# EAGLE schematic dimmerPower3 (EAGLE 9.2.0)
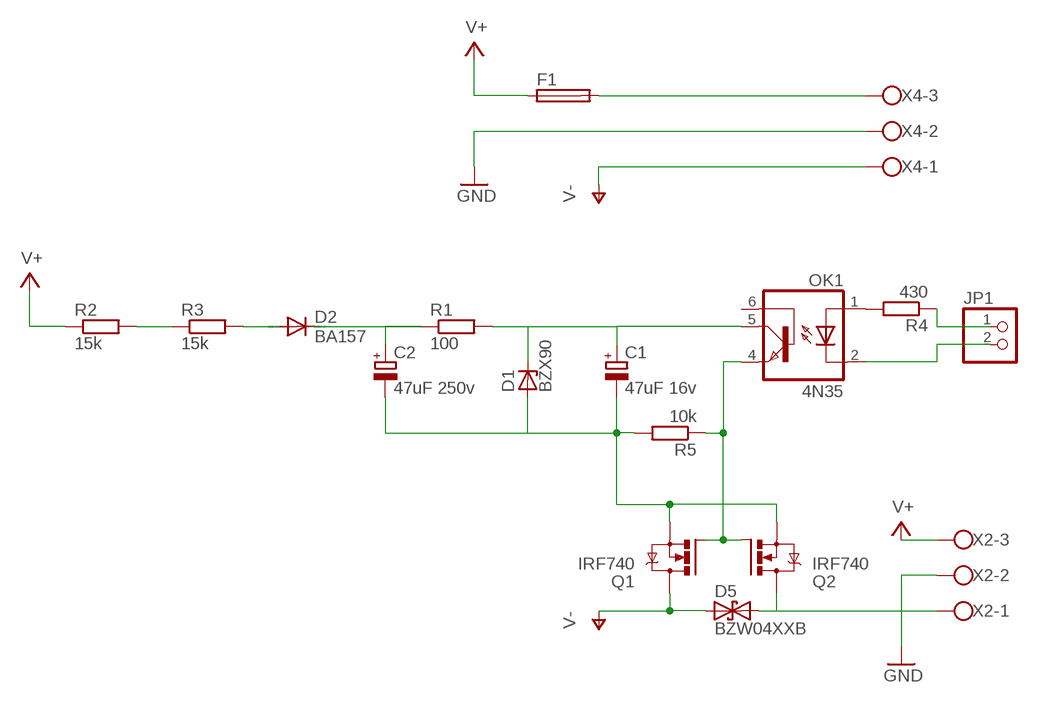
[diagram p0: schematic, sheet 1]

## Parts
C1  47uF 16v  CPOL-EUE2.5-6  [E2,5-6]
C2  47uF 250v  CPOL-EUE5-13  [E5-13]
D1  BZX90  [DO34Z7]
D2  BA157  [P1-10]
D5  BZW04XXB  [F126Z12]
F1  SH22,5  [SH22,5]
JP1  PINHD-1X2  [1X02]
OK1  4N35  [DIL06]
Q1  IRF740  [TO220BV]
Q2  IRF740  [TO220BV]
R1  100  R-EU_0204/7  [0204/7]
R2  15k  R-EU_0613/15  [P0613/15]
R3  15k  R-EU_0613/15  [P0613/15]
R4  430  R-EU_0204/7  [0204/7]
R5  10k  R-EU_0204/7  [0204/7]
X2  W237-103  [W237-103]
X4  W237-103  [W237-103]

## Nets
GND: X2.2 X4.2
N$2: JP1.1 R4.1
N$3: OK1.1(A) R4.2
N$4 [signal]: JP1.2 OK1.2(C)
N$7: R2.2 R3.1
N$8: D2.A R3.2
N$9: C2.+ D2.C R1.1
N$10: C1.+ D1.C OK1.5(COL) R1.2
N$11: OK1.4(EMI) Q1.G Q2.G R5.1
N$12: D5.C Q2.D X2.1
N$17: C1.- C2.- D1.A Q1.S Q2.S R5.2
V+: F1.1 R2.1 X2.3
V+1: F1.2 X4.3
V-: D5.A Q1.D X4.1
Unconnected: OK1.6(BAS)

## Library data of the parts
C1 C2 = rcl:CPOL-EU: POLARIZED CAPACITOR, European symbol; SPICEPREFIX: C
D1 = diode:BZX90: Z DIODE
D2 = diode:BA157: DIODE fast soft-recovery controlled avalanche rectifier
D5 = diode:BZW04XXB: DIODE uni and bidirectional supressor diode
F1 = fuse:SH22,5: FUSE HOLDER grid 22,5 mm, OGN0031 8201, Schurter (Buerklin); MF: SCHURTER; MPN: 0031.8201; OC_FARNELL: 1162740; OC_NEWARK: 96F8317
JP1 = pinhead:PINHD-1X2: PIN HEADER
OK1 = optocoupler:4N35: MOTOROLA OPTO COUPLER; MF: FAIRCHILD SEMICONDUCTOR; MPN: 4N35; OC_FARNELL: 1328375; OC_NEWARK: 72K9946
Q1 Q2 = transistor-power:IRF740: N-CHANNEL MOS FET
R1-R5 = rcl:R-EU_: RESISTOR, European symbol; SPICEPREFIX: R
X2 X4 = con-wago-500:W237-103: WAGO SCREW CLAMP; MPN: 237-103; OC_FARNELL: unknown; OC_NEWARK: 18M7116

## Net classes
1 signal: width 1.27 mm, clearance 0.508 mm
2 power: width 2.54 mm, clearance 0.508 mm